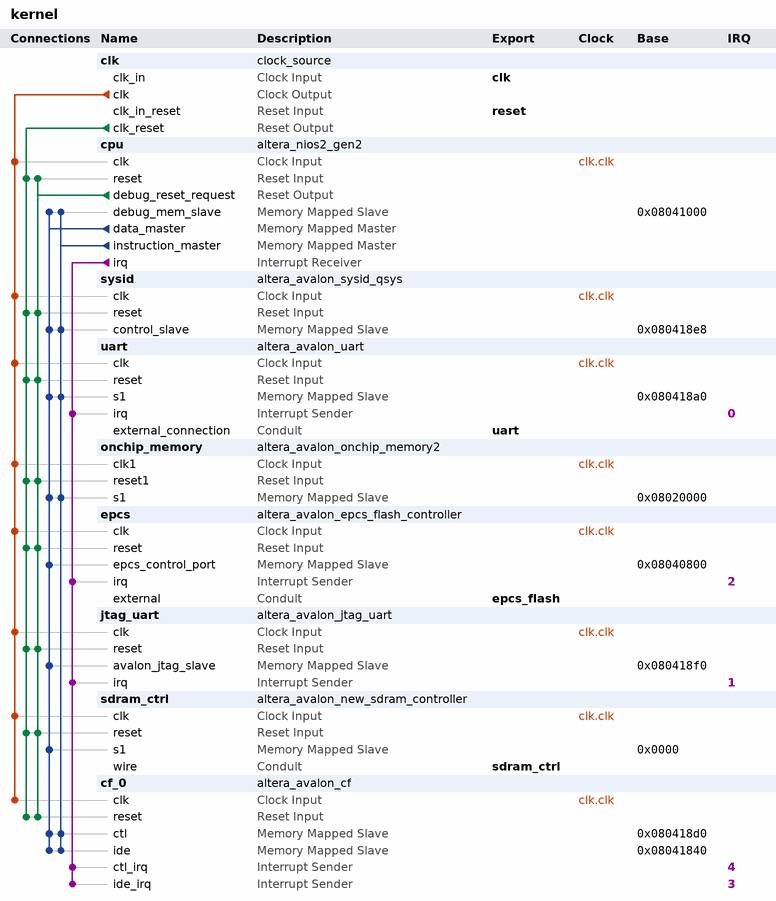
[diagram p0: system contents]
# Platform Designer (Qsys) system kernel, Cyclone IV GX EP4CGX150DF27C7
# Parameters at their usual value, and those the tool derives, are not listed.
package require -exact qsys 14.1
create_system kernel
set_project_property DEVICE_FAMILY {Cyclone IV GX}
set_project_property DEVICE EP4CGX150DF27C7

add_instance clk clock_source 14.1
set_instance_parameter_value clk clockFrequency 50000000

add_instance cpu altera_nios2_gen2 14.1
set_instance_parameter_value cpu dcache_size 2048
set_instance_parameter_value cpu exceptionSlave onchip_memory.s1
set_instance_parameter_value cpu icache_size 4096
set_instance_parameter_value cpu impl Fast
set_instance_parameter_value cpu resetSlave onchip_memory.s1
set_instance_parameter_value cpu setting_activateTrace true

add_instance sysid altera_avalon_sysid_qsys 14.1
set_instance_parameter_value sysid id 268435455

add_instance uart altera_avalon_uart 14.1
set_instance_parameter_value uart baud 115200
set_instance_parameter_value uart dataBits 8
set_instance_parameter_value uart fixedBaud true
set_instance_parameter_value uart parity NONE
set_instance_parameter_value uart stopBits 1

add_instance onchip_memory altera_avalon_onchip_memory2 14.1
set_instance_parameter_value onchip_memory dataWidth 32
set_instance_parameter_value onchip_memory dualPort false
set_instance_parameter_value onchip_memory initMemContent true
set_instance_parameter_value onchip_memory initializationFileName onchip_mem.hex
set_instance_parameter_value onchip_memory memorySize 81920

add_instance epcs altera_avalon_epcs_flash_controller 14.1
set_instance_parameter_value epcs resetrequest_enabled true

add_instance jtag_uart altera_avalon_jtag_uart 14.1
set_instance_parameter_value jtag_uart simInteractiveOptions NO_INTERACTIVE_WINDOWS

add_instance sdram_ctrl altera_avalon_new_sdram_controller 14.1
set_instance_parameter_value sdram_ctrl TAC 5.4
set_instance_parameter_value sdram_ctrl TRCD 20.0
set_instance_parameter_value sdram_ctrl TRP 20.0
set_instance_parameter_value sdram_ctrl casLatency 2
set_instance_parameter_value sdram_ctrl columnWidth 10
set_instance_parameter_value sdram_ctrl dataWidth 16
set_instance_parameter_value sdram_ctrl generateSimulationModel false
set_instance_parameter_value sdram_ctrl model single_Micron_MT48LC4M32B2_7_chip
set_instance_parameter_value sdram_ctrl numberOfBanks 4
set_instance_parameter_value sdram_ctrl numberOfChipSelects 1
set_instance_parameter_value sdram_ctrl powerUpDelay 100.0
set_instance_parameter_value sdram_ctrl refreshPeriod 31.25
set_instance_parameter_value sdram_ctrl rowWidth 14

add_instance cf_0 altera_avalon_cf 14.1

# connections
add_connection clk.clk cf_0.clk clock
add_connection clk.clk cpu.clk clock
add_connection clk.clk epcs.clk clock
add_connection clk.clk jtag_uart.clk clock
add_connection clk.clk onchip_memory.clk1 clock
add_connection clk.clk sdram_ctrl.clk clock
add_connection clk.clk sysid.clk clock
add_connection clk.clk uart.clk clock
add_connection clk.clk_reset cf_0.reset reset
add_connection clk.clk_reset cpu.reset reset
add_connection clk.clk_reset epcs.reset reset
add_connection clk.clk_reset jtag_uart.reset reset
add_connection clk.clk_reset onchip_memory.reset1 reset
add_connection clk.clk_reset sdram_ctrl.reset reset
add_connection clk.clk_reset sysid.reset reset
add_connection clk.clk_reset uart.reset reset
add_connection cpu.debug_reset_request cf_0.reset reset
add_connection cpu.debug_reset_request cpu.reset reset
add_connection cpu.debug_reset_request epcs.reset reset
add_connection cpu.debug_reset_request jtag_uart.reset reset
add_connection cpu.debug_reset_request onchip_memory.reset1 reset
add_connection cpu.debug_reset_request sdram_ctrl.reset reset
add_connection cpu.debug_reset_request sysid.reset reset
add_connection cpu.debug_reset_request uart.reset reset
add_connection cpu.data_master cf_0.ctl avalon
set_connection_parameter_value cpu.data_master/cf_0.ctl baseAddress 0x080418d0
add_connection cpu.data_master cf_0.ide avalon
set_connection_parameter_value cpu.data_master/cf_0.ide baseAddress 0x08041840
add_connection cpu.data_master cpu.debug_mem_slave avalon
set_connection_parameter_value cpu.data_master/cpu.debug_mem_slave baseAddress 0x08041000
add_connection cpu.data_master epcs.epcs_control_port avalon
set_connection_parameter_value cpu.data_master/epcs.epcs_control_port baseAddress 0x08040800
add_connection cpu.data_master jtag_uart.avalon_jtag_slave avalon
set_connection_parameter_value cpu.data_master/jtag_uart.avalon_jtag_slave baseAddress 0x080418f0
add_connection cpu.data_master onchip_memory.s1 avalon
set_connection_parameter_value cpu.data_master/onchip_memory.s1 baseAddress 0x08020000
add_connection cpu.data_master sdram_ctrl.s1 avalon
set_connection_parameter_value cpu.data_master/sdram_ctrl.s1 baseAddress 0x0000
add_connection cpu.data_master sysid.control_slave avalon
set_connection_parameter_value cpu.data_master/sysid.control_slave baseAddress 0x080418e8
add_connection cpu.data_master uart.s1 avalon
set_connection_parameter_value cpu.data_master/uart.s1 baseAddress 0x080418a0
add_connection cpu.instruction_master cf_0.ctl avalon
set_connection_parameter_value cpu.instruction_master/cf_0.ctl baseAddress 0x080418d0
add_connection cpu.instruction_master cf_0.ide avalon
set_connection_parameter_value cpu.instruction_master/cf_0.ide baseAddress 0x08041840
add_connection cpu.instruction_master cpu.debug_mem_slave avalon
set_connection_parameter_value cpu.instruction_master/cpu.debug_mem_slave baseAddress 0x08041000
add_connection cpu.instruction_master onchip_memory.s1 avalon
set_connection_parameter_value cpu.instruction_master/onchip_memory.s1 baseAddress 0x08020000
add_connection cpu.instruction_master sysid.control_slave avalon
set_connection_parameter_value cpu.instruction_master/sysid.control_slave baseAddress 0x080418e8
add_connection cpu.instruction_master uart.s1 avalon
set_connection_parameter_value cpu.instruction_master/uart.s1 baseAddress 0x080418a0
add_connection cpu.irq cf_0.ctl_irq interrupt
set_connection_parameter_value cpu.irq/cf_0.ctl_irq irqNumber 4
add_connection cpu.irq cf_0.ide_irq interrupt
set_connection_parameter_value cpu.irq/cf_0.ide_irq irqNumber 3
add_connection cpu.irq epcs.irq interrupt
set_connection_parameter_value cpu.irq/epcs.irq irqNumber 2
add_connection cpu.irq jtag_uart.irq interrupt
set_connection_parameter_value cpu.irq/jtag_uart.irq irqNumber 1
add_connection cpu.irq uart.irq interrupt
set_connection_parameter_value cpu.irq/uart.irq irqNumber 0

# exported interfaces
add_interface clk clock sink
set_interface_property clk EXPORT_OF clk.clk_in
add_interface epcs_flash conduit end
set_interface_property epcs_flash EXPORT_OF epcs.external
add_interface reset reset sink
set_interface_property reset EXPORT_OF clk.clk_in_reset
add_interface sdram_ctrl conduit end
set_interface_property sdram_ctrl EXPORT_OF sdram_ctrl.wire
add_interface uart conduit end
set_interface_property uart EXPORT_OF uart.external_connection

set_interconnect_requirement {$system} qsys_mm.clockCrossingAdapter HANDSHAKE
set_interconnect_requirement {$system} qsys_mm.insertDefaultSlave FALSE
set_interconnect_requirement {$system} qsys_mm.maxAdditionalLatency 1

save_system kernel.qsys
